# EAGLE design arduino_board_2iter (EAGLE 9.6.2)
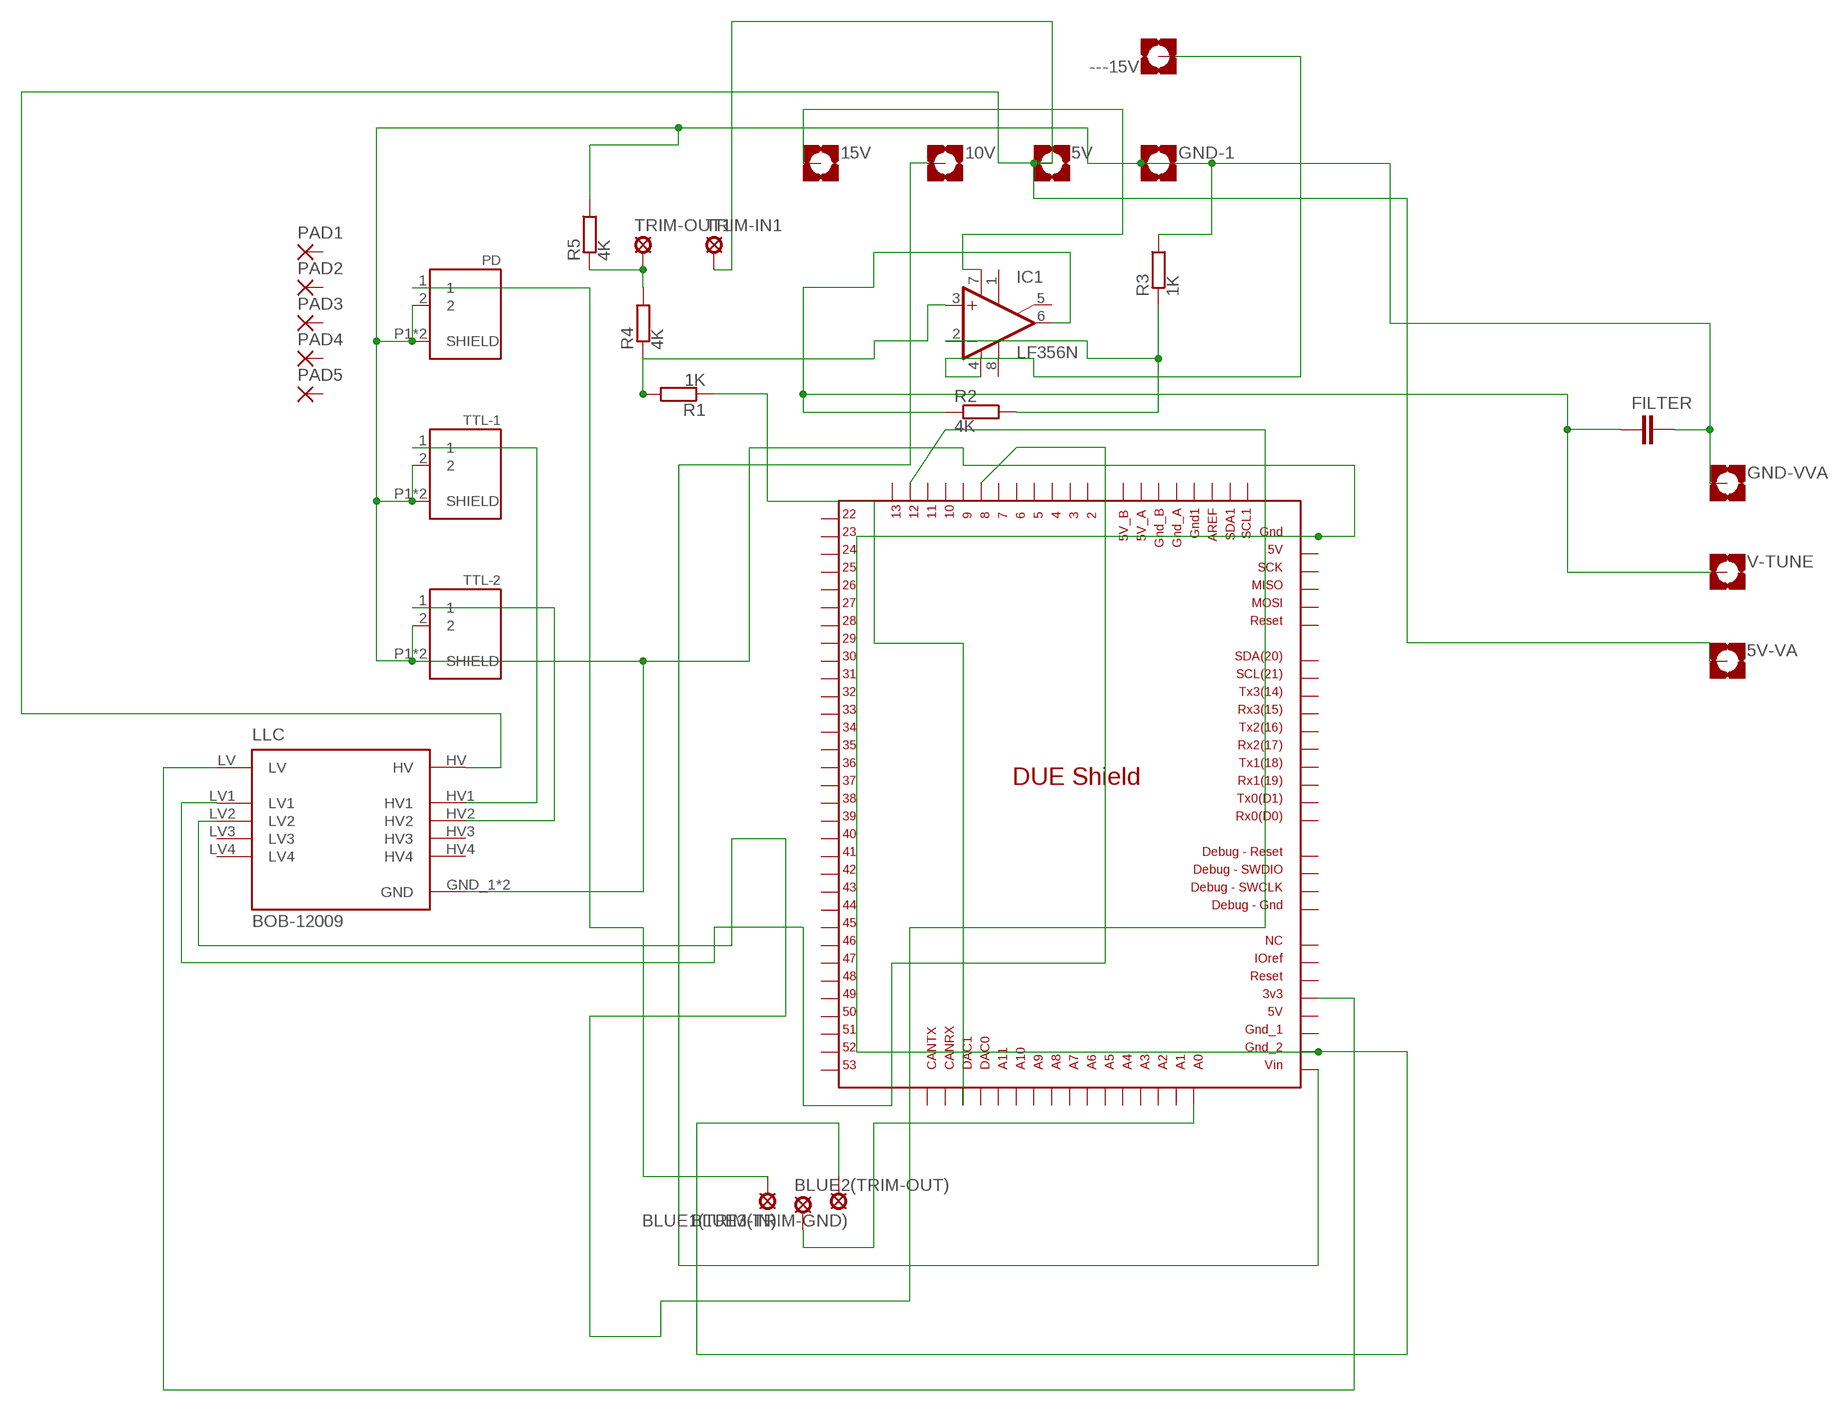
[diagram p0: schematic, sheet 1]

## Parts
5V  MOUNT-PAD-SQUARE2.8  [2,8-PAD-SQUARE]
5V-VA  MOUNT-PAD-SQUARE2.8  [2,8-PAD-SQUARE]
10V  MOUNT-PAD-SQUARE2.8  [2,8-PAD-SQUARE]
15V  MOUNT-PAD-SQUARE2.8  [2,8-PAD-SQUARE]
---15V  MOUNT-PAD-SQUARE2.8  [2,8-PAD-SQUARE]
BLUE1(TRIM-IN)  LSP10  [LSP10]
BLUE2(TRIM-OUT)  LSP10  [LSP10]
BLUE3(TRIM-GND)  LSP10  [LSP10]
FILTER  C-EUC1812K  [C1812K]
GND-1  MOUNT-PAD-SQUARE2.8  [2,8-PAD-SQUARE]
GND-VVA  MOUNT-PAD-SQUARE2.8  [2,8-PAD-SQUARE]
IC1  LF356N  [DIL08]
LLC  BOB-12009  [CONV_BOB-12009]
PAD1  1,6/0,9  [1,6/0,9]
PAD2  1,6/0,9  [1,6/0,9]
PAD3  1,6/0,9  [1,6/0,9]
PAD4  1,6/0,9  [1,6/0,9]
PAD5  1,6/0,9  [1,6/0,9]
PD  1-1337543-0  [CONN_1-1337543-0]
R1  1K  SMS-0  [SMS-0]
R2  4K  SMS-0  [SMS-0]
R3  1K  SMS-0  [SMS-0]
R4  4K  SMS-0  [SMS-0]
R5  4K  SMS-0  [SMS-0]
TRIM-IN1  LSP10  [LSP10]
TRIM-OUT1  LSP10  [LSP10]
TTL-1  1-1337543-0  [CONN_1-1337543-0]
TTL-2  1-1337543-0  [CONN_1-1337543-0]
U$1  DUE(NORMAL)  [DUE(NORMAL)]
V-TUNE  MOUNT-PAD-SQUARE2.8  [2,8-PAD-SQUARE]

## Nets
GND: BLUE3(TRIM-GND).MP FILTER.2 GND-1.B2,8(MOUNT) GND-VVA.B2,8(MOUNT) LLC.GND_1(GND) LLC.GND_2(GND) PD.2 PD.P1(SHIELD) PD.P2(SHIELD) R3.1 R5.1 TTL-1.2 TTL-1.P1(SHIELD) TTL-1.P2(SHIELD) TTL-2.2 TTL-2.P1(SHIELD) TTL-2.P2(SHIELD) U$1.5V_ICSP U$1.GND_2
N$3: IC1.3(+IN) R1.1 R4.2
N$4: FILTER.1 IC1.6(OUT) R2.2 V-TUNE.B2,8(MOUNT)
N$5: IC1.2(-IN) R2.1 R3.2
N$6: 10V.B2,8(MOUNT) U$1.VIN
N$7: R1.2 U$1.DAC1
N$8: 15V.B2,8(MOUNT) IC1.7(V+)
N$11: LLC.LV U$1.3V3
N$12: LLC.HV1 TTL-1.1
N$13: LLC.HV2 TTL-2.1
N$14: BLUE1(TRIM-IN).MP PD.1
N$15: 5V-VA.B2,8(MOUNT) 5V.B2,8(MOUNT) LLC.HV TRIM-IN1.MP
N$16: LLC.LV2 U$1.12
N$17: BLUE2(TRIM-OUT).MP U$1.A0
N$20: R4.1 R5.2 TRIM-OUT1.MP
N$21: ---15V.B2,8(MOUNT) IC1.4(V-)
N$22: LLC.LV1 U$1.8
Unconnected: IC1.1(ON1) IC1.5(ON2) IC1.8(OPT) LLC.HV3 LLC.HV4 LLC.LV3 LLC.LV4 PAD1.1(P) PAD2.1(P) PAD3.1(P) PAD4.1(P) PAD5.1(P) U$1.2 U$1.3 U$1.4 U$1.5 U$1.5V U$1.5V_A U$1.5V_B U$1.6 U$1.7 U$1.9 U$1.10 U$1.11 U$1.13 U$1.22 U$1.23 U$1.24 U$1.25 U$1.26 U$1.27 U$1.28 U$1.29 U$1.30 U$1.31 U$1.32 U$1.33 U$1.34 U$1.35 U$1.36 U$1.37 U$1.38 U$1.39 U$1.40 U$1.41 U$1.42 U$1.43 U$1.44 U$1.45 U$1.46 U$1.47 U$1.48 U$1.49 U$1.50 U$1.51 U$1.52 U$1.53 U$1.A1 U$1.A2 U$1.A3 U$1.A4 U$1.A5 U$1.A6 U$1.A7 U$1.A8 U$1.A9 U$1.A10 U$1.A11 U$1.AREF U$1.CANRX U$1.CANTX U$1.DAC0 U$1.GND1 U$1.GND_1 U$1.GND_A U$1.GND_B U$1.GND_DEBUG U$1.GND_ICSP U$1.IOREF U$1.MISO_ICSP U$1.MOSI_ICSP U$1.NC U$1.RESET U$1.RESET_DEBUG U$1.RESET_ICSP U$1.RX0 U$1.RX1 U$1.RX2 U$1.RX3 U$1.SCK_ICSP U$1.SCL U$1.SCL1 U$1.SDA U$1.SDA1 U$1.SWCLK_DEBUG U$1.SWDIO_DEBUG U$1.TX0 U$1.TX1 U$1.TX2 U$1.TX3

## Library data of the parts
5V 5V-VA 10V 15V ---15V GND-1 GND-VVA V-TUNE = holes:MOUNT-PAD-SQUARE: MOUNTING PAD, square
BLUE1(TRIM-IN) BLUE2(TRIM-OUT) BLUE3(TRIM-GND) TRIM-IN1 TRIM-OUT1 = solpad:LSP10: SOLDER PAD drill 1.0 mm, distributor Buerklin, 12H555
FILTER = rcl:C-EU: CAPACITOR, European symbol; SPICEPREFIX: C
IC1 = linear:LF356: OP AMP
LLC = BOB-12009:BOB-12009: Logic Level Converter - Bi-Direc Check prices <https://pricing.snapeda.com/parts/BOB-12009/SparkFun/view-part?ref=eda>; AVAILABILITY: In Stock; DESCRIPTION: BSS138 Logic-Level Translator Interface Evaluation Board; MF: SparkFun; MP: BOB-12009; PACKAGE: None; PRICE: None; PURCHASE-URL: https://pricing.snapeda.com/search/part/BOB-12009/?ref=eda
PAD1-PAD5 = wirepad:1,6/0,9: THROUGH-HOLE PAD
PD TTL-1 TTL-2 = jayich_lab_eagle_library:1-1337543-0: BNC appliance socket, right angle [TE Connectivity] 1-1337543-0 BNC appliance socket, right angle; COMMENT: 1-1337543-0; DESCRIPTION: BNC Ins R/A PCB Skt 50Ohm White; DIGI-KEY_PART_NUMBER: A97553-ND; DIGI-KEY_PURCHASE_URL: https://www.digikey.com/product-detail/en/te-connectivity-amp-connectors/1-1337543-0/A97553-ND/1755940?utm_source=snapeda&utm_medium=aggregator&utm_campaign=symbol; MF: TE Connectivity; MP: 1-1337543-0; NUMBER_OF_POSITIONS: 1; PACKAGE: None; TE_PURCHASE_URL: https://www.te.com/usa-en/product-1-1337543-0.html?te_bu=Cor&te_type=disp&te_campaign=seda_glo_cor-seda-global-disp-prtnr-fy19-seda-model-bom-cta_sma-317_1&elqCampaignId=32493
R1-R5 = resistor-shunt:SMS-0: SMD SHUNT RESISTOR; OC_FARNELL: unknown; OC_NEWARK: unknown
U$1 = DUElib130425:DUE(NORMAL)

## Board
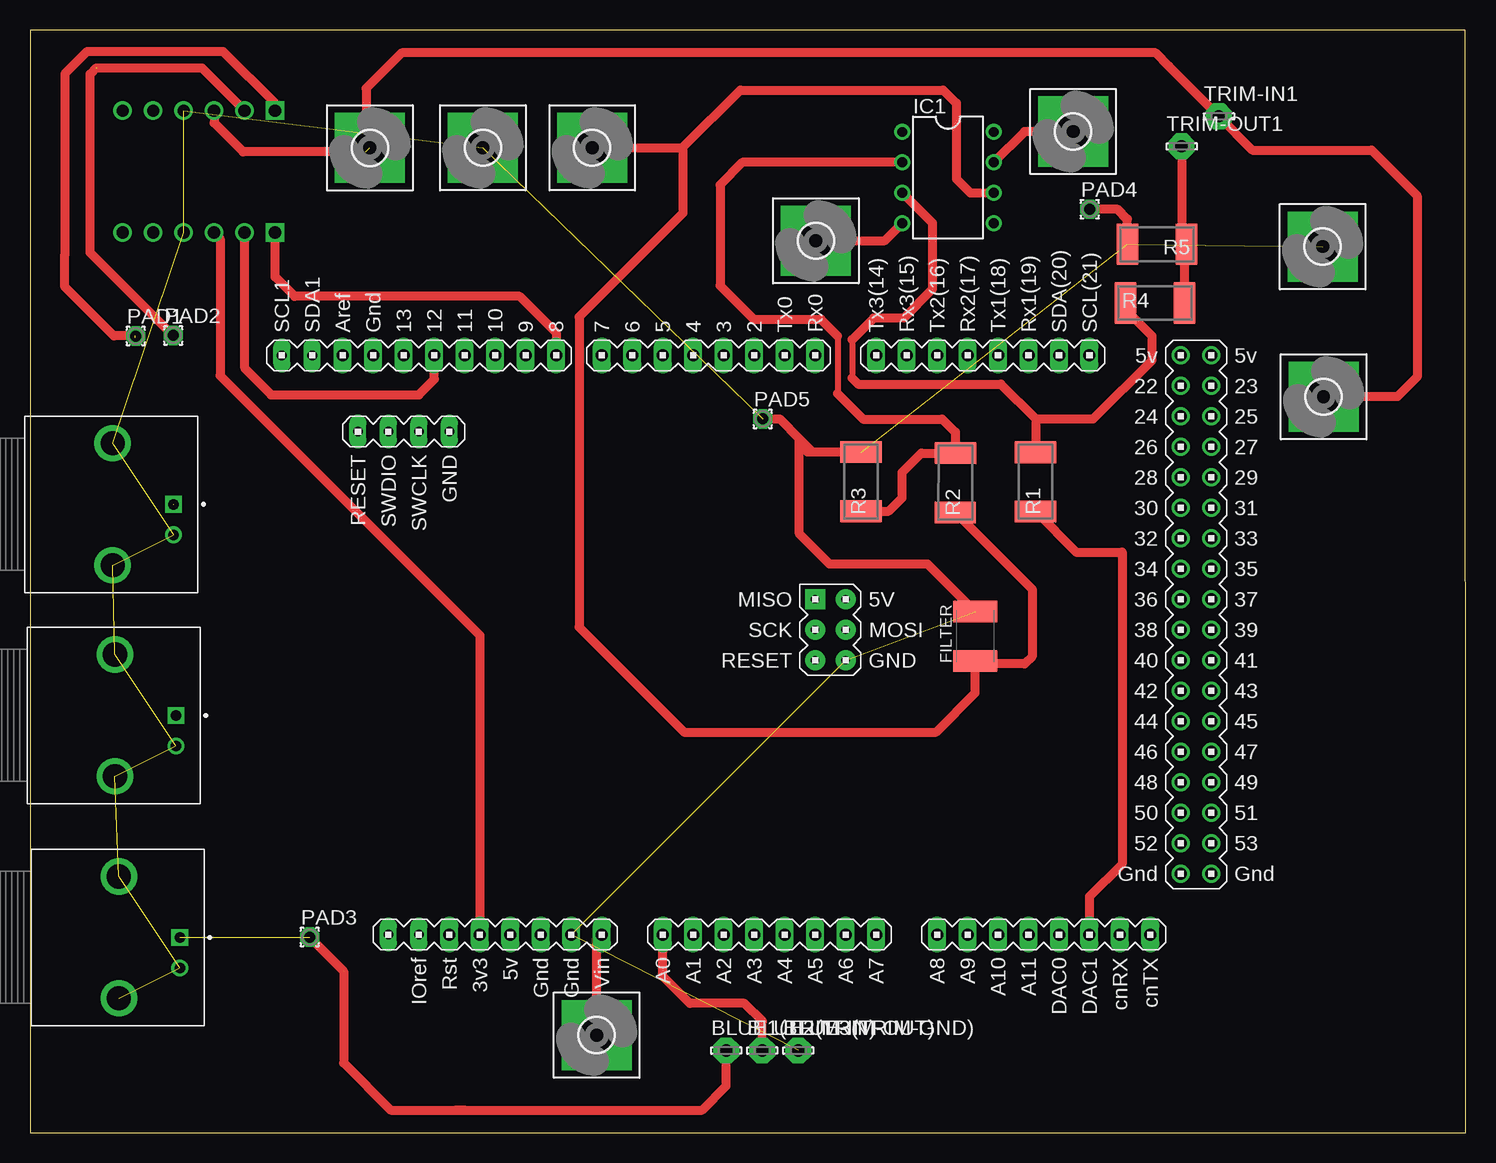
[diagram p1: board, top side]
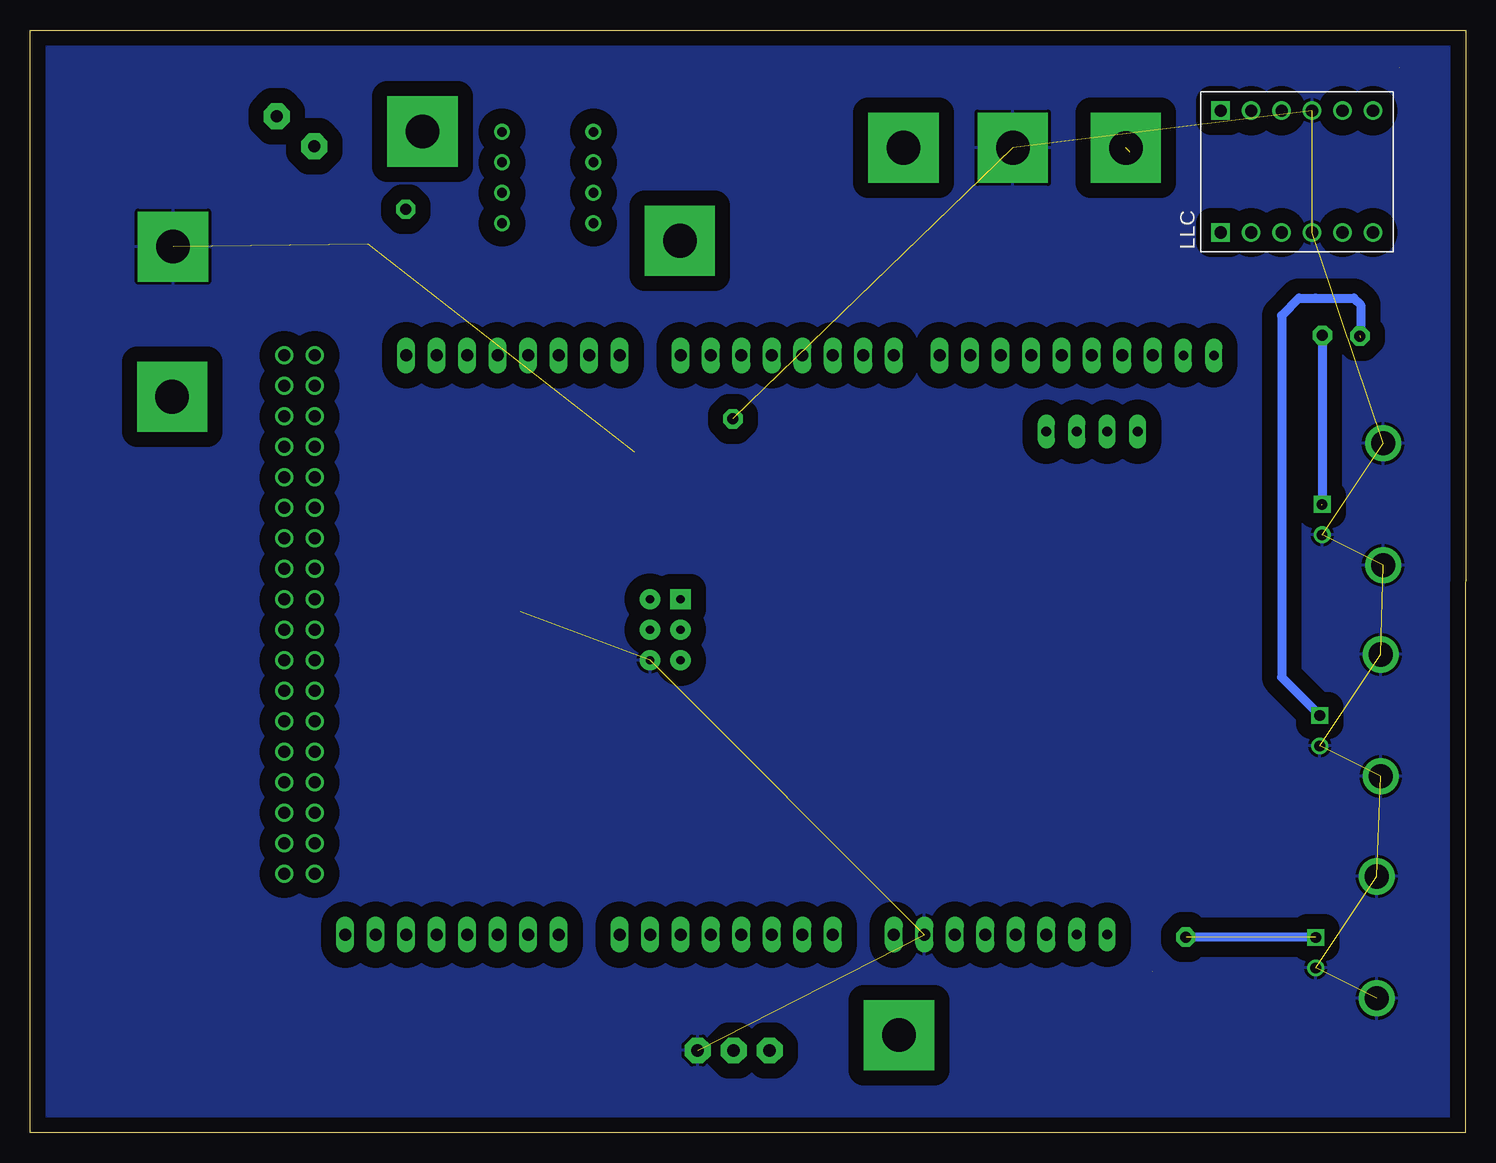
[diagram p2: board, bottom side, seen from below]

Size 119.64 x 91.91 mm. Coordinates in mm from the lower left corner, seen from the top.
Outline: 0.04,0 119.64,0 119.6,91.91 0,91.91 0.04,0
Copper layers (1*16): Top 0.035mm / dielectric 1.5mm / Bottom 0.035mm
Design rules "default": minimum track width 6mil, minimum drill 0.35mm, track to track 6mil, track to pad 6mil, pad to pad 6mil, via to via 6mil, smd to smd 6mil, copper to edge 40mil, drill to drill 6mil, minimum pad ring 10mil, minimum via ring 8mil, stop-mask expansion 4mil, vias tented up to drill 0mil, thermal gap 10mil

### Footprints (pad centres in the part's own frame; a part is rotated, then mirrored left to right if it is on the bottom)
2,8-PAD-SQUARE = drill 2.8 pad 5.842 square: B2,8 0,0
LSP10 = drill 1.016 pad 2.159 octagon: MP 0,0
C1812K = smd 1.8 x 3.7: 1 -2.05,0; 2 2.05,0
DIL08 = drill 0.813 pad 1.27: 1 -3.81,-3.81; 2 -1.27,-3.81; 3 1.27,-3.81; 4 3.81,-3.81; 5 3.81,3.81; 6 1.27,3.81; 7 -1.27,3.81; 8 -3.81,3.81
CONV_BOB-12009 = drill 1.016: GND_1 5.08,-1.27; GND_2 -5.08,-1.27; HV 5.08,1.27; HV2 5.08,3.81; HV3 5.08,-3.81; HV4 5.08,-6.35; LV -5.08,1.27; LV2 -5.08,3.81; LV3 -5.08,-3.81; LV4 -5.08,-6.35 | drill 1.016 square: HV1 5.08,6.35; LV1 -5.08,6.35
1,6/0,9 = drill 0.914 pad 1.6 octagon: 1 0,0
CONN_1-1337543-0 = drill 0.89 square: 1 0,0 | drill 0.89: 2 0,-2.54 | drill 2.01: P1 -5.08,-5.08; P2 -5.08,5.08
SMS-0 = smd 1.8 x 3.45: 1 2.464,0; 2 -2.464,0
DUE(NORMAL) = drill 1 long: 2 -16.51,30.48; 3 -19.05,30.48; 3V3 -39.37,-17.78; 4 -21.59,30.48; 5 -24.13,30.48; 5V -36.83,-17.78; 6 -26.67,30.48; 7 -29.21,30.48; 8 -33.02,30.48; 9 -35.56,30.48; 10 -38.1,30.48; 11 -40.64,30.48; 12 -43.18,30.48; 13 -45.72,30.48; A0 -24.13,-17.78; A1 -21.59,-17.78; A2 -19.05,-17.78; A3 -16.51,-17.78; A4 -13.97,-17.78; A5 -11.43,-17.78; A6 -8.89,-17.78; A7 -6.35,-17.78; A8 -1.27,-17.78; A9 1.27,-17.78; A10 3.81,-17.78; A11 6.35,-17.78; AREF -50.8,30.48; AREF1 -50.8,30.48; CANRX 13.97,-17.78; CANTX 16.51,-17.78; DAC0 8.89,-17.78; DAC1 11.43,-17.78; GND1 -48.26,30.48; GND_1 -34.29,-17.78; GND_2 -31.75,-17.78; RESET -41.91,-17.78; RX0 -11.43,30.48; RX1 6.35,30.48; RX2 1.27,30.48; RX3 -3.81,30.48; SCL 11.43,30.48; SDA 8.89,30.48; TX0 -13.97,30.48; TX1 3.81,30.48; TX2 -1.27,30.48; TX3 -6.35,30.48; VIN -29.21,-17.78 | drill 1: 5V_A 19.05,30.48; 5V_B 21.59,30.48; 22 19.05,27.94; 23 21.59,27.94; 24 19.05,25.4; 25 21.59,25.4; 26 19.05,22.86; 27 21.59,22.86; 28 19.05,20.32; 29 21.59,20.32; 30 19.05,17.78; 31 21.59,17.78; 32 19.05,15.24; 33 21.59,15.24; 34 19.05,12.7; 35 21.59,12.7; 36 19.05,10.16; 37 21.59,10.16; 38 19.05,7.62; 39 21.59,7.62; 40 19.05,5.08; 41 21.59,5.08; 42 19.05,2.54; 43 21.59,2.54; 44 19.05,0; 45 21.59,0; 46 19.05,-2.54; 47 21.59,-2.54; 48 19.05,-5.08; 49 21.59,-5.08; 50 19.05,-7.62; 51 21.59,-7.62; 52 19.05,-10.16; 53 21.59,-10.16; GND_A 19.05,-12.7; GND_B 21.59,-12.7 | drill 0.7 pad 1.676: 5V_ICSP -8.89,5.08; GND_ICSP -8.89,10.16; MOSI_ICSP -8.89,7.62; RESET_ICSP -11.43,5.08; SCK_ICSP -11.43,7.62 | drill 0.8 pad 1.422 long: GND_DEBUG -41.91,24.13; IOREF -44.45,-17.78; NC -46.99,-17.78; RESET_DEBUG -49.53,24.13; SCL1 -55.88,30.48; SDA1 -53.34,30.48; SWCLK_DEBUG -44.45,24.13; SWDIO_DEBUG -46.99,24.13 | drill 0.7 pad 1.676 square: MISO_ICSP -11.43,10.16

### Placement (x,y rotation side)
5V  107.8,61.35 0 top
5V-VA  28.32,82.09 0 top
10V  47.22,8.15 0 top
15V  86.93,83.45 0 top
---15V  65.49,74.35 0 top
BLUE1(TRIM-IN)  58.01,6.87 0 top
BLUE2(TRIM-OUT)  61.01,6.87 0 top
BLUE3(TRIM-GND)  64.01,6.87 0 top
FILTER  78.77,41.39 90 top
GND-1  107.72,73.86 0 top
GND-VVA  37.74,82.1 0 top
IC1  76.5,79.61 270 top
LLC  14.07,80.11 90 bottom
PAD1  8.81,66.41 0 top
PAD2  11.94,66.46 0 top
PAD3  23.32,16.32 0 top
PAD4  88.32,76.97 0 top
PAD5  61.06,59.5 0 top
PD  12.49,16.29 0 top
R1  83.8,54.26 90 top
R2  77.11,54.18 89.9 top
R3  69.25,54.27 90 top
R4  93.74,69.16 0 top
R5  93.92,74.06 180 top
TRIM-IN1  99.07,84.71 0 top
TRIM-OUT1  95.96,82.21 0 top
TTL-1  12.16,34.79 0 top
TTL-2  11.96,52.38 0 top
U$1  76.86,34.31 0 top
V-TUNE  46.85,82.1 0 top

### Tracks (layer width: path | path; a pad name or v marks a point on that pad's centre or on a via)
GND  (17 unrouted)
  Top 0.75: 69.17,56.81 R3.1 65.24,56.73 | R5.1 91.46,76.15 90.65,76.96 88.29,76.96 | 65.24,56.73 64.78,56.73 | FILTER.2 74.8,47.41 66.63,47.41 64.11,49.93 64.11,57.79 64.15,57.83 | 65.24,56.73 64.15,57.83 | 64.15,57.83 62.47,59.5 61.07,59.5
  pour Bottom (isolate 1.27, rank 6): 0,91.91 0,-0.26 120,-0.26 120,91.91
N$3
  Top 0.5: 68.5,66.11 68.5,62.91
  Top 0.75: 83.8,57.22 R1.1 83.8,59.51 | IC1.3 75.2,75.83 75.2,70.31 72.8,67.91 70.3,67.91 68.5,66.11 | 68.5,62.91 69,62.41 80.9,62.41 83.8,59.51 | 83.8,59.51 88.6,59.51 93.5,64.41 93.5,66.41 91.28,68.63 R4.2
N$4
  Top 0.75: V-TUNE.B2,8 54.41,82.1 | 54.41,82.1 54.41,82.12 59.2,86.91 76.1,86.91 77.2,85.81 77.2,79.51 78.37,78.34 IC1.6 | 54.41,82.1 54.41,76.65 45.76,68 45.76,42.15 54.5,33.41 75.5,33.41 78.77,36.68 78.77,38.61 | 78.77,38.61 FILTER.1 | R2.2 83.51,45.31 83.51,39.7 82.89,39.08 79.24,39.08 78.77,38.61
N$5
  Top 0.5: 67.3,66.41 67.3,61.61
  Top 0.75: IC1.2 59.37,80.88 57.5,79.01 57.5,70.61 60.3,67.81 65.9,67.81 67.3,66.41 | 67.3,61.61 69.42,59.49 76.02,59.49 77.11,58.4 R2.1 74.27,56.64 72.67,55.04 72.67,52.92 71.56,51.81 R3.2
N$6
  Top 0.75: 10V.B2,8 47.22,16.1 U$1.VIN
N$7
  Top 0.75: R1.2 87.19,48.41 91,48.41 91,22.41 88.29,19.7 U$1.DAC1
N$8
  Top 0.75: 15V.B2,8 82.88,83.45 IC1.7
N$11
  Top 0.75: U$1.3V3 37.49,41.46 15.84,63.11 15.84,74.53 LLC.LV
N$12  (via drill 0.35)  (1 unrouted)
  Top 0.152: 16.07,90.14 16.09,90.12
  Top 0.75: 16.09,90.12 20.42,85.79 LLC.HV1 | 16.07,90.14 4.79,90.14 2.9,88.25 2.9,73.22 2.91,73.21 2.91,70.49 7,66.41 v8.77,66.41
  Bottom 0.75: 11.97,34.98 TTL-1.1 15.34,37.97 15.34,68.11 13.9,69.56 12.53,69.56 9.32,69.56 8.76,69 8.76,66.26
N$13  (via drill 0.35)  (2 unrouted)
  Top 0.152: v11.97,66.43 11.94,66.43
  Top 0.75: 5.53,88.75 5.01,88.23 5.01,73.36 11.94,66.43 | LLC.HV2 14.32,88.75 5.55,88.75
  Bottom 0.152: 11.97,52.38 TTL-2.1
  Bottom 0.75: 12,52.37 11.94,52.43 | v11.97,66.43 11.97,52.38
N$14  (via drill 0.35)  (2 unrouted)
  Top 0.152: BLUE1(TRIM-IN).MP
  Top 0.75: 36.22,1.91 56,1.91 58.02,3.93 BLUE1(TRIM-IN).MP | 36.22,1.91 35.5,1.91 | 26.13,13.46 v23.3,16.29 | 26.13,13.46 26.13,5.83 30.06,1.9 36.21,1.9 36.22,1.91
  Bottom 0.75: PD.1 v23.3,16.29
N$15  (via drill 0.35)  (3 unrouted)
  Top 0.75: 5V.B2,8 113.94,61.35 115.6,63.01 115.6,78.11 111.8,81.91 101.87,81.91 TRIM-IN1.MP 94.9,88.88 94.9,88.91 93.8,90.01 30.97,90.01 28,87.04 28,81.77 27.98,81.73 | v27.98,81.74 17.77,81.74 15.34,84.17 LLC.HV
N$16
  Top 0.75: U$1.12 33.68,62.83 33.7,62.81 32.4,61.51 20.1,61.51 17.9,63.71 17.9,75.01 LLC.LV2
N$17
  Top 0.152: 61.01,9.25 61.05,9.29
  Top 0.75: U$1.A0 52.73,15.72 52.73,15.15 52.73,13.05 54.98,10.8 59.54,10.8 61.05,9.29 | BLUE2(TRIM-OUT).MP 61.01,9.25
N$20
  Top 0.75: 95.96,74.09 R5.2 96.2,73.88 R4.1 | 95.96,74.09 TRIM-OUT1.MP 96.16,82.41 | 95.96,72.87 95.96,74.09
N$21
  Top 0.75: ---15V.B2,8 71.24,74.35 IC1.4
N$22
  Top 0.75: U$1.8 43.84,66.67 40.8,69.71 22.05,69.71 20.42,71.34 LLC.LV1